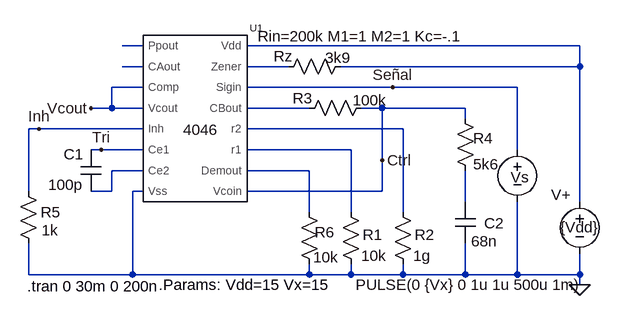
[diagram p0: schematic 1KhzTst.asc]
1KhzTst.asc, the LTspice schematic file:
Version 4
SHEET 1 1128 680
WIRE 16 128 -16 128
WIRE 688 128 176 128
WIRE 16 160 -16 160
WIRE 240 160 176 160
WIRE 688 160 688 128
WIRE 688 160 320 160
WIRE 16 192 -32 192
WIRE 400 192 176 192
WIRE 592 192 400 192
WIRE -32 224 -32 192
WIRE -32 224 -64 224
WIRE 16 224 -32 224
WIRE 272 224 176 224
WIRE 384 224 352 224
WIRE 512 224 384 224
WIRE 512 240 512 224
WIRE -144 256 -160 256
WIRE 16 256 -144 256
WIRE 416 256 176 256
WIRE -48 288 -64 288
WIRE 16 288 -48 288
WIRE 336 288 176 288
WIRE 592 288 592 192
WIRE 384 304 384 224
WIRE 16 320 -32 320
WIRE 272 320 176 320
WIRE -160 352 -160 256
WIRE -32 352 -32 320
WIRE -32 352 -64 352
WIRE 16 352 0 352
WIRE 384 352 384 304
WIRE 384 352 176 352
WIRE 512 368 512 320
WIRE 688 368 688 160
WIRE 272 384 272 320
WIRE 336 384 336 288
WIRE 416 384 416 256
WIRE -160 480 -160 432
WIRE 0 480 0 352
WIRE 0 480 -160 480
WIRE 272 480 272 464
WIRE 272 480 0 480
WIRE 336 480 336 464
WIRE 336 480 272 480
WIRE 416 480 416 464
WIRE 416 480 336 480
WIRE 512 480 512 432
WIRE 512 480 416 480
WIRE 592 480 592 368
WIRE 592 480 512 480
WIRE 688 480 688 448
WIRE 688 480 592 480
WIRE 688 496 688 480
FLAG 688 496 0
FLAG -64 224 Vcout
FLAG -48 288 Tri
FLAG -144 256 Inh
FLAG 400 192 Señal
FLAG 384 304 Ctrl
SYMBOL res 320 368 R0
WINDOW 0 34 51 Left 0
WINDOW 3 32 83 Left 0
SYMATTR InstName R1
SYMATTR Value 10k
SYMBOL res 336 144 R90
WINDOW 0 16 104 VBottom 0
WINDOW 3 -13 20 VTop 0
SYMATTR InstName Rz
SYMATTR Value 3k9
SYMBOL res 368 208 R90
WINDOW 0 16 106 VBottom 0
WINDOW 3 -12 3 VTop 0
SYMATTR InstName R3
SYMATTR Value 100k
SYMBOL cap -80 288 R0
WINDOW 3 -50 54 Left 0
WINDOW 0 -26 7 Left 0
SYMATTR Value 100p
SYMATTR InstName C1
SYMBOL res 256 368 R0
WINDOW 0 24 47 Left 0
WINDOW 3 22 85 Left 0
SYMATTR InstName R6
SYMATTR Value 10k
SYMBOL res 400 368 R0
WINDOW 0 34 51 Left 0
WINDOW 3 32 83 Left 0
SYMATTR InstName R2
SYMATTR Value 1g
SYMBOL voltage 592 272 R0
WINDOW 0 -10 58 Left 0
WINDOW 3 -249 224 Left 0
WINDOW 123 0 0 Left 0
WINDOW 39 0 0 Left 0
SYMATTR InstName Vs
SYMATTR Value PULSE(0 {Vx} 0 1u 1u 500u 1m)
SYMBOL res -176 336 R0
WINDOW 0 35 48 Left 0
SYMATTR InstName R5
SYMATTR Value 1k
SYMBOL res 496 224 R0
WINDOW 0 28 46 Left 0
WINDOW 3 28 86 Left 0
SYMATTR InstName R4
SYMATTR Value 5k6
SYMBOL cap 496 368 R0
WINDOW 0 45 33 Left 0
WINDOW 3 25 61 Left 0
SYMATTR InstName C2
SYMATTR Value 68n
SYMBOL voltage 688 352 R0
WINDOW 0 -44 5 Left 0
WINDOW 3 -30 55 Left 0
WINDOW 123 0 0 Left 0
WINDOW 39 0 0 Left 0
SYMATTR InstName V+
SYMATTR Value {Vdd}
SYMBOL X4046 96 224 R0
WINDOW 39 255 -111 Center 0
SYMATTR InstName U1
TEXT -162 498 Left 0 !.tran 0 30m 0 200n
TEXT 40 496 Left 0 !.Params: Vdd=15 Vx=15

The netlist it stands for:
* 1KhzTst.asc
R1 N007 0 10k
Rz N002 N004 3k9
R3 Ctrl N005 100k
C1 Tri N008 100p
R6 N009 0 10k
R2 N006 0 1g
Vs Señal 0 PULSE(0 {Vx} 0 1u 1u 500u 1m)
R5 Inh 0 1k
R4 Ctrl N010 5k6
C2 N010 0 68n
V+ N002 0 {Vdd}
XU1 N001 N003 Vcout Vcout Inh Tri N008 0 Ctrl N009 N007 N006 N005 Señal N004 N002 4046 4046 Rin=200k M1=1 M2=1 Kc=-.1  ; pins Ppout CAout Comp Vcout Inh Ce1 Ce2 Vss Vcoin Demout r1 r2 CBout Sigin Zener Vdd
.tran 0 30m 0 200n
.Params: Vdd=15 Vx=15
.lib X4046.Lib
.backanno
.end